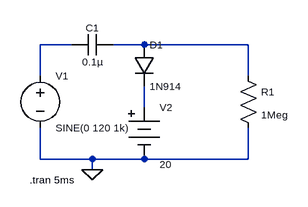
[diagram p0: schematic 3. Clamper Circuit.asc]
3. Clamper Circuit.asc, the LTspice schematic file:
Version 4
SHEET 1 880 680
WIRE 112 96 64 96
WIRE 224 96 176 96
WIRE 384 96 224 96
WIRE 64 144 64 96
WIRE 384 144 384 96
WIRE 224 192 224 160
WIRE 64 272 64 224
WIRE 144 272 64 272
WIRE 224 272 144 272
WIRE 384 272 384 224
WIRE 384 272 224 272
WIRE 144 288 144 272
FLAG 144 288 0
SYMBOL voltage 64 128 R0
WINDOW 123 0 0 Left 0
WINDOW 39 0 0 Left 0
WINDOW 0 24 16 Left 1
WINDOW 3 24 96 Left 1
SYMATTR InstName V1
SYMATTR Value SINE(0 120 1k)
SYMBOL diode 208 96 R0
WINDOW 0 24 0 Left 1
WINDOW 3 24 64 Left 1
SYMATTR InstName D1
SYMATTR Value 1N914
SYMBOL Misc\\battery 224 176 R0
WINDOW 123 0 0 Left 0
WINDOW 39 0 0 Left 0
WINDOW 0 24 16 Left 1
WINDOW 3 24 104 Left 1
SYMATTR InstName V2
SYMATTR Value 20
SYMBOL res 368 128 R0
WINDOW 0 36 40 Left 1
WINDOW 3 36 76 Left 1
SYMATTR InstName R1
SYMATTR Value 1Meg
SYMBOL cap 176 80 R90
WINDOW 0 0 32 VBottom 1
WINDOW 3 32 32 VTop 1
SYMATTR InstName C1
SYMATTR Value 0.1µ
TEXT 48 304 Left 1 !.tran 5ms

The netlist it stands for:
* 3. Clamper Circuit.asc
V1 N001 0 SINE(0 120 1k)
D1 N002 N003 1N914
V2 N003 0 20
R1 N002 0 1Meg
C1 N002 N001 0.1µ
.model D D
.lib standard.dio
.tran 5ms
.backanno
.end